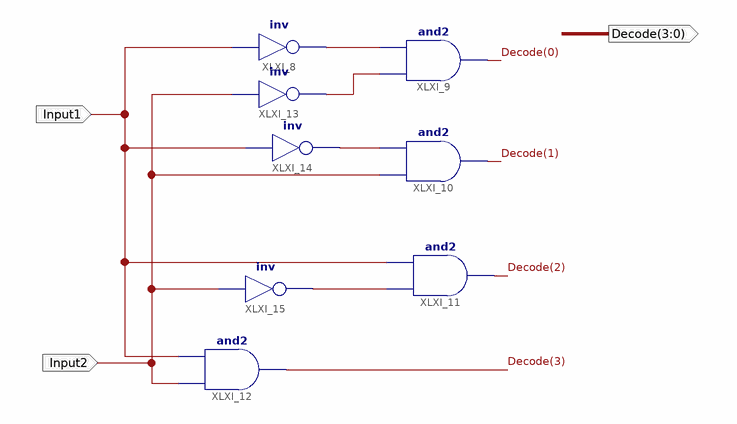
[diagram p0: schematic sheet 1]
// Xilinx ISE schematic Decoder2_4.sch (spartan6) as structural Verilog: 8 symbols, 3 ports
module Decoder2_4 (
  input  Input1,
  input  Input2,
  output [3:0] Decode
);

  wire XLXN_17, XLXN_18, XLXN_19, XLXN_20;

  not XLXI_8 (XLXN_19, Input1);
  and XLXI_9 (Decode[0], XLXN_18, XLXN_19);
  and XLXI_10 (Decode[1], Input2, XLXN_17);
  and XLXI_11 (Decode[2], XLXN_20, Input1);
  and XLXI_12 (Decode[3], Input2, Input1);
  not XLXI_13 (XLXN_18, Input2);
  not XLXI_14 (XLXN_17, Input1);
  not XLXI_15 (XLXN_20, Input2);
endmodule
